# Altium schematic sheet 10_PRAM_RTC_WDT.SchDoc
size 420 x 297 mm; SheetNumber: 10; SheetTotal: 27
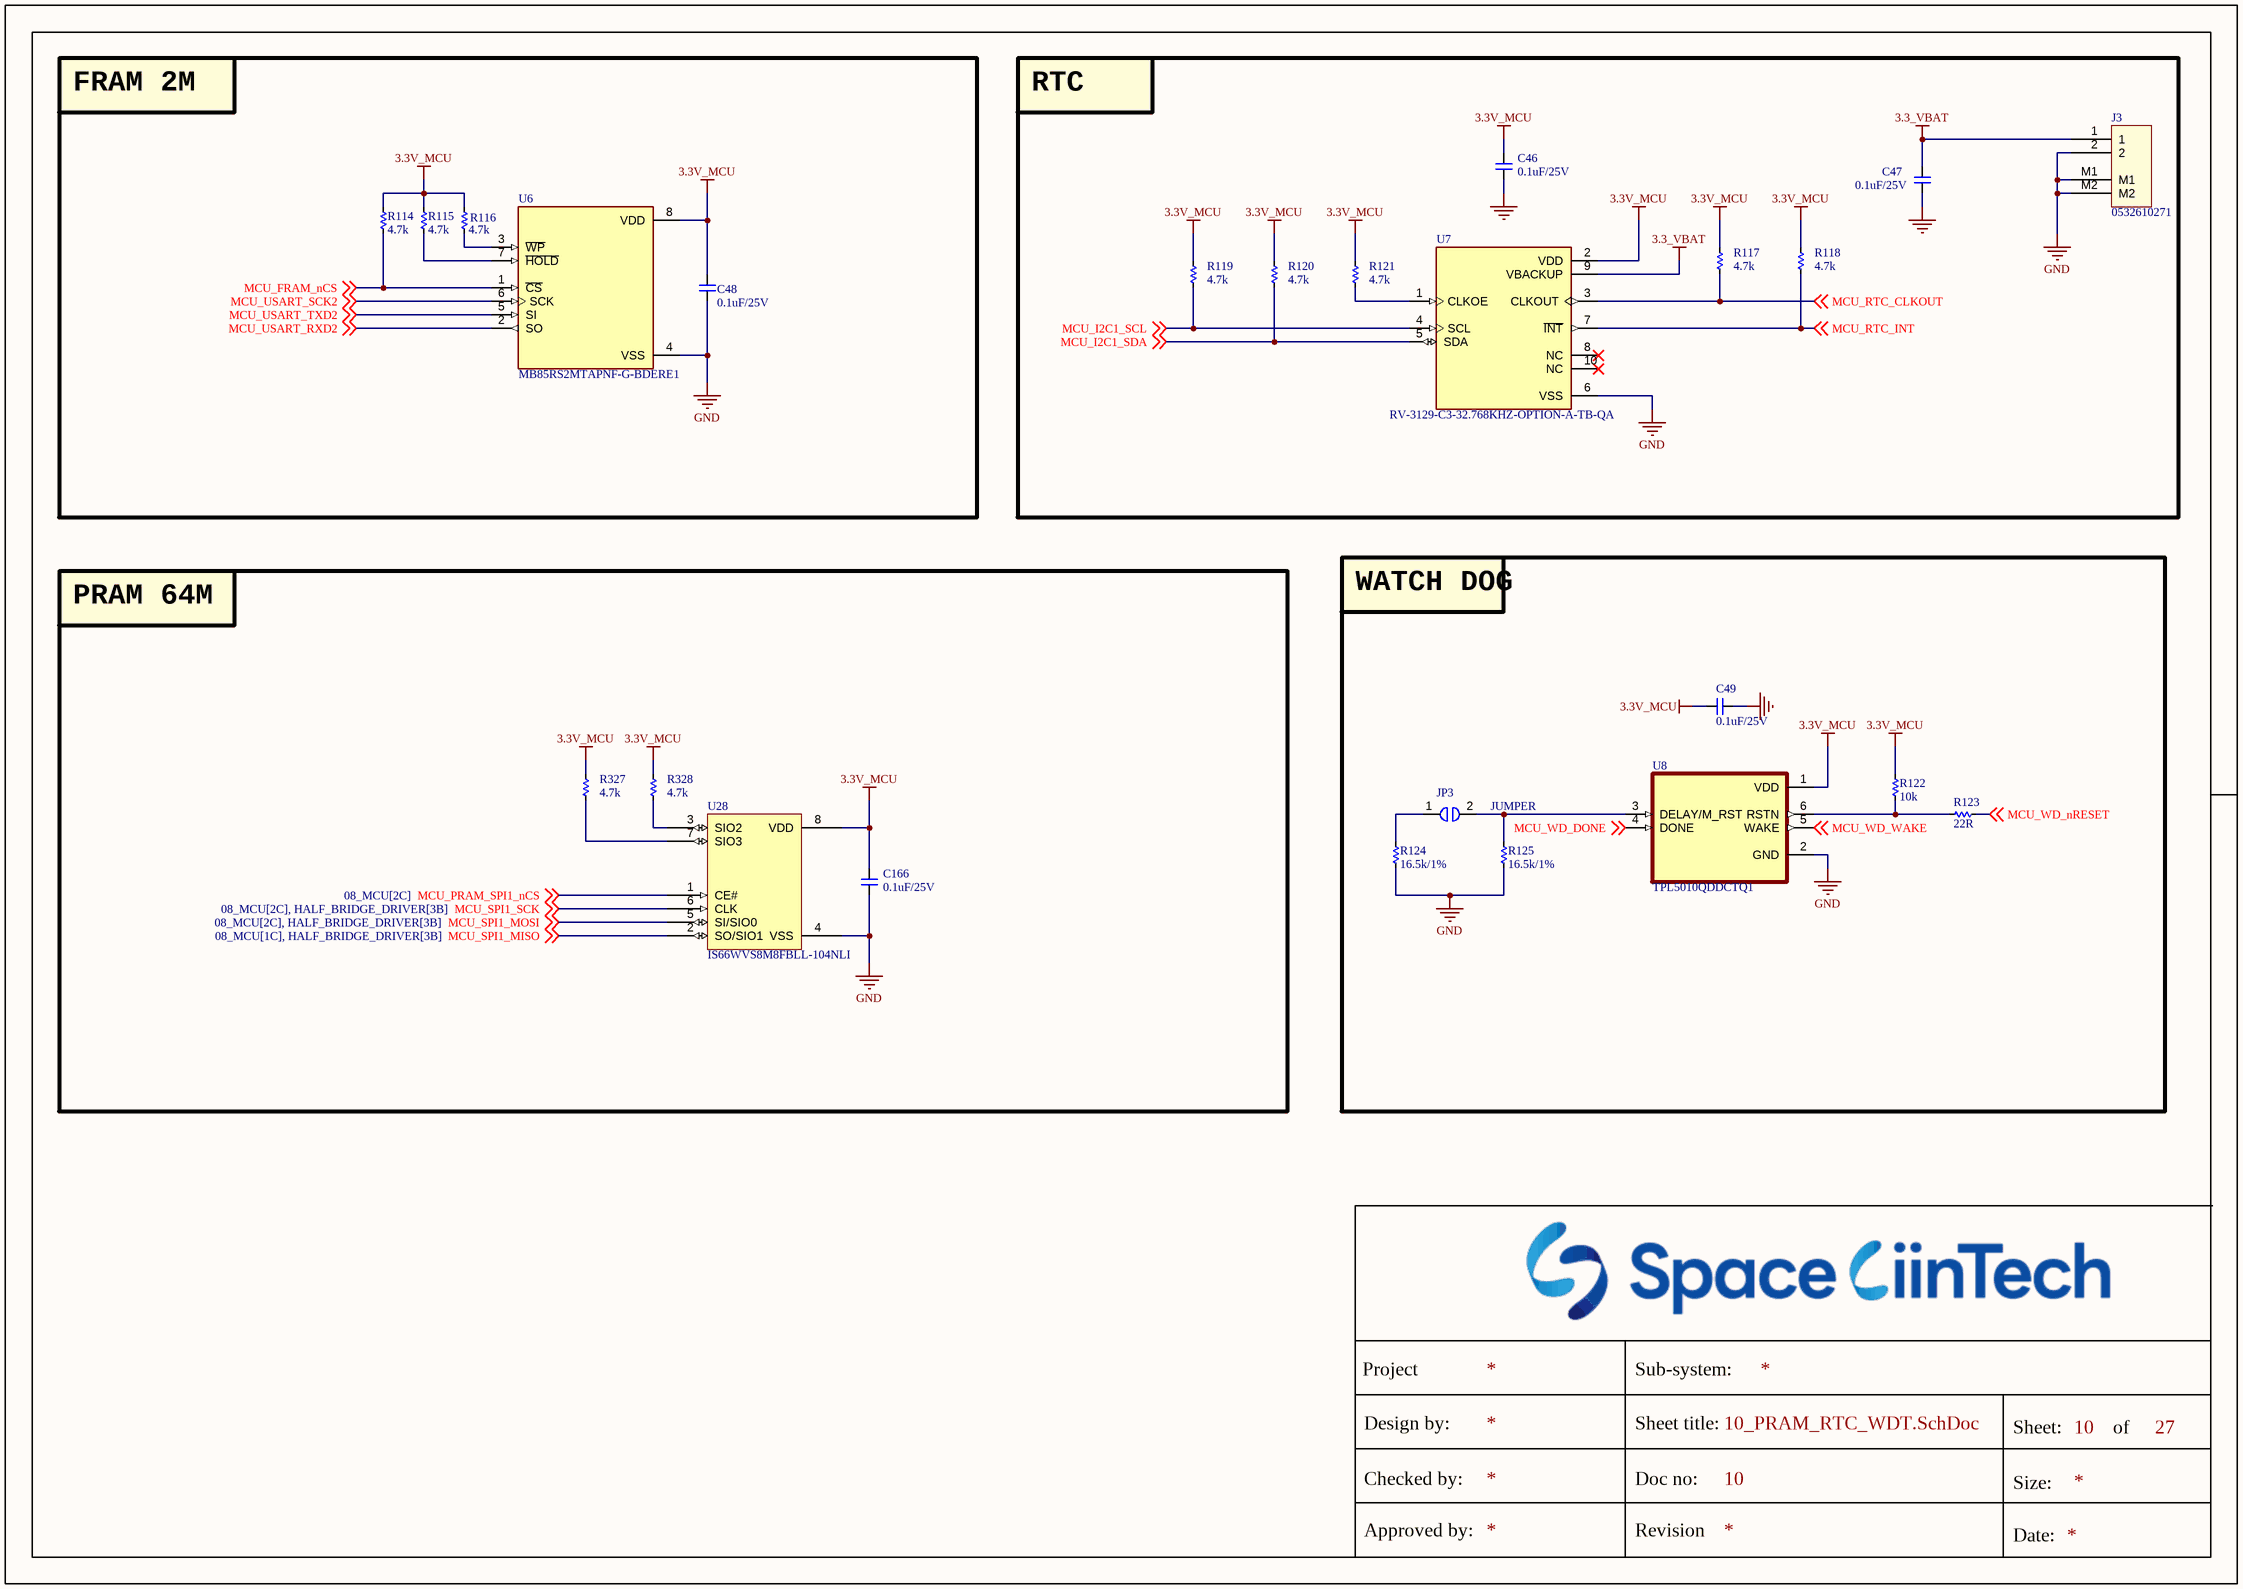
[diagram p0: 10_PRAM_RTC_WDT.SchDoc]

## Parts
C46  0.1uF/25V  [CAP_C_1005X60]
C47  0.1uF/25V  [CAP_C_1005X60]
C48  0.1uF/25V  [CAP_C_1005X60]
C49  0.1uF/25V  [CAP_C_1005X60]
C166  0.1uF/25V  [CAP_C_1005X60]
J3  0532610271  [MOLEX_0532610271]
JP3  JUMPER  [JUMPER_1608]
R114  4.7k  [RES_C_1005X40]
R115  4.7k  [RES_C_1005X40]
R116  4.7k  [RES_C_1005X40]
R117  4.7k  [RES_C_1005X40]
R118  4.7k  [RES_C_1005X40]
R119  4.7k  [RES_C_1005X40]
R120  4.7k  [RES_C_1005X40]
R121  4.7k  [RES_C_1005X40]
R122  10k  [RES_C_1005X40]
R123  22R  [RES_C_1005X40]
R124  16.5k/1%  [RES_C_1005X40]
R125  16.5k/1%  [RES_C_1005X40]
R327  4.7k  [RES_C_1005X40]
R328  4.7k  [RES_C_1005X40]
U6  MB85RS2MTAPNF-G-BDERE1  [SOIC127P602X173-8N]
U7  RV-3129-C3-32.768KHZ-OPTION-A-TB-QA  [IC_RV-3129-C3_32.768KHZ_OPTION_A_TB_QA]
U8  TPL5010QDDCTQ1  [SOT95P280X145-6N]
U28  IS66WVS8M8FBLL-104NLI  [SOIC8_150MIL_N_ISI]

## Blocks framed on the sheet
FRAM 2M: C48 R114-R116 U6
RTC: C46 C47 J3 R117-R121 U7
PRAM 64M: C166 R327 R328 U28
WATCH DOG: C49 JP3 R122-R125 U8

## Nets
3.3_VBAT: C47.2 J3.1 U7.9(VBACKUP)
3.3V_MCU: C46.2 C48.2 C49.2 C166.1 R114.2 R115.2 R116.2 R117.2 R118.2 R119.2 R120.2 R121.1 R122.2 R327.2 R328.2 U6.8(VDD) U7.2(VDD) U8.1(VDD) U28.8(VDD)
GND: C46.1 C47.1 C48.1 C49.1 C166.2 J3.2 J3.M1 J3.M2 R124.1 R125.1 U6.4(VSS) U7.6(VSS) U8.2(GND) U28.4(VSS)
MCU_FRAM_nCS: R114.1 U6.1(~{CS}) ; off-sheet MCU_FRAM_nCS
MCU_I2C1_SCL: R119.1 U7.4(SCL) ; off-sheet MCU_I2C1_SCL
MCU_I2C1_SDA: R120.1 U7.5(SDA) ; off-sheet MCU_I2C1_SDA
MCU_PRAM_SPI1_nCS: U28.1(CE#) ; off-sheet MCU_PRAM_SPI1_nCS
MCU_RTC_CLKOUT: R117.1 U7.3(CLKOUT) ; off-sheet MCU_RTC_CLKOUT
MCU_RTC_INT: R118.1 U7.7(~{INT}) ; off-sheet MCU_RTC_INT
MCU_SPI1_MISO: U28.2(SO/SIO1) ; off-sheet MCU_SPI1_MISO
MCU_SPI1_MOSI: U28.5(SI/SIO0) ; off-sheet MCU_SPI1_MOSI
MCU_SPI1_SCK: U28.6(CLK) ; off-sheet MCU_SPI1_SCK
MCU_USART_RXD2: U6.2(SO) ; off-sheet MCU_USART_RXD2
MCU_USART_SCK2: U6.6(SCK) ; off-sheet MCU_USART_SCK2
MCU_USART_TXD2: U6.5(SI) ; off-sheet MCU_USART_TXD2
MCU_WD_DONE: U8.4(DONE) ; off-sheet MCU_WD_DONE
MCU_WD_nRESET: R123.1 ; off-sheet MCU_WD_nRESET
MCU_WD_WAKE: U8.5(WAKE) ; off-sheet MCU_WD_WAKE
NetJP3_1: JP3.1 R124.2
NetJP3_2: JP3.2 R125.2 U8.3(DELAY/M_RST)
NetR115_1: R115.1 U6.7(~{HOLD})
NetR116_1: R116.1 U6.3(~{WP})
NetR121_2: R121.2 U7.1(CLKOE)
NetR122_1: R122.1 R123.2 U8.6(RSTN)
NetR327_1: R327.1 U28.7(SIO3)
NetR328_1: R328.1 U28.3(SIO2)

Not connected (* = marked no-connect by the designer): U7 8(NC)* 10(NC)*

## Notes on the sheet
- Project
- Sub-system:
- Design by:
- Sheet title:
- Sheet:
- of
- Checked by:
- Approved by:
- Doc no:
- Revision
- Size:
- Date:

## Library data of the parts
C46-C49 C166 = _CAP_C_2: CAP
J3 = Header 2x1_2M
JP3 = JUMPER_1_1
R114-R125 R327 R328 = _RES_B_2: RES
U6 = MB85RS2MTAPNF-G-BDERE1: FRAM _Ferroelectric RAM_ Memory IC 2Mb _256K x 8_ SPI 40MHz 8-SOP; MF: Fujitsu Electronics; Package: SO-8 Fujitsu; Value: *; Digi-Key_Purchase_URL: https://www.digikey.com/product-detail/en/fujitsu-electronics-america-inc/MB85RS2MTAPNF-G-BDERE1/865-1286-1-ND/7916252?utm_source=snapeda&utm_medium=aggregator&utm_campaign=symbol; Digi-Key_Part_Number: 865-1286-1-ND; SnapEDA_Link: https://www.snapeda.com/parts/MB85RS2MTAPNF-G-BDERE1/Fujitsu%20Electronics%20America%2C%20Inc./view-part/2344795/?ref=snap; MP: MB85RS2MTAPNF-G-BDERE1
U7 = RV-3129-C3_32.768KHZ_OPTION_A_TB_QA: Real-Time Clock Module, Temperature compensated, in 2.5 x 3.7 mm package; MF: Micro Crystal; MP: RV-3129-C3 32.768KHZ OPTION A TB QA; SnapEDA_Link: https://www.snapeda.com/parts/RV-3129-C3%2032.768KHZ%20OPTION%20A%20TB%20QA/Micro+Crystal/view-part/?ref=snap; Package: QFN-10 Micro Crystal; Value: *; Check_prices: https://www.snapeda.com/parts/RV-3129-C3%2032.768KHZ%20OPTION%20A%20TB%20QA/Micro+Crystal/view-part/?ref=eda
U28 = IS66WVS4M8BLL-104NLI: No Description Available; Manufacturer_Name: ISSI; Type: Memory; Copyright: Copyright (C) 2025 Ultra Librarian. All rights reserved.; Manufacturer_Part_Number: IS66WVS4M8BLL-104NLI; RefDes: RefDes
U8 = TPL5010QDDCTQ1: Package: None; Price: None; Value: *; MP: TPL5010QDDCTQ1; Availability: Unavailable